# Altium schematic sheet NAVC.SchDoc
size 297 x 209 mm
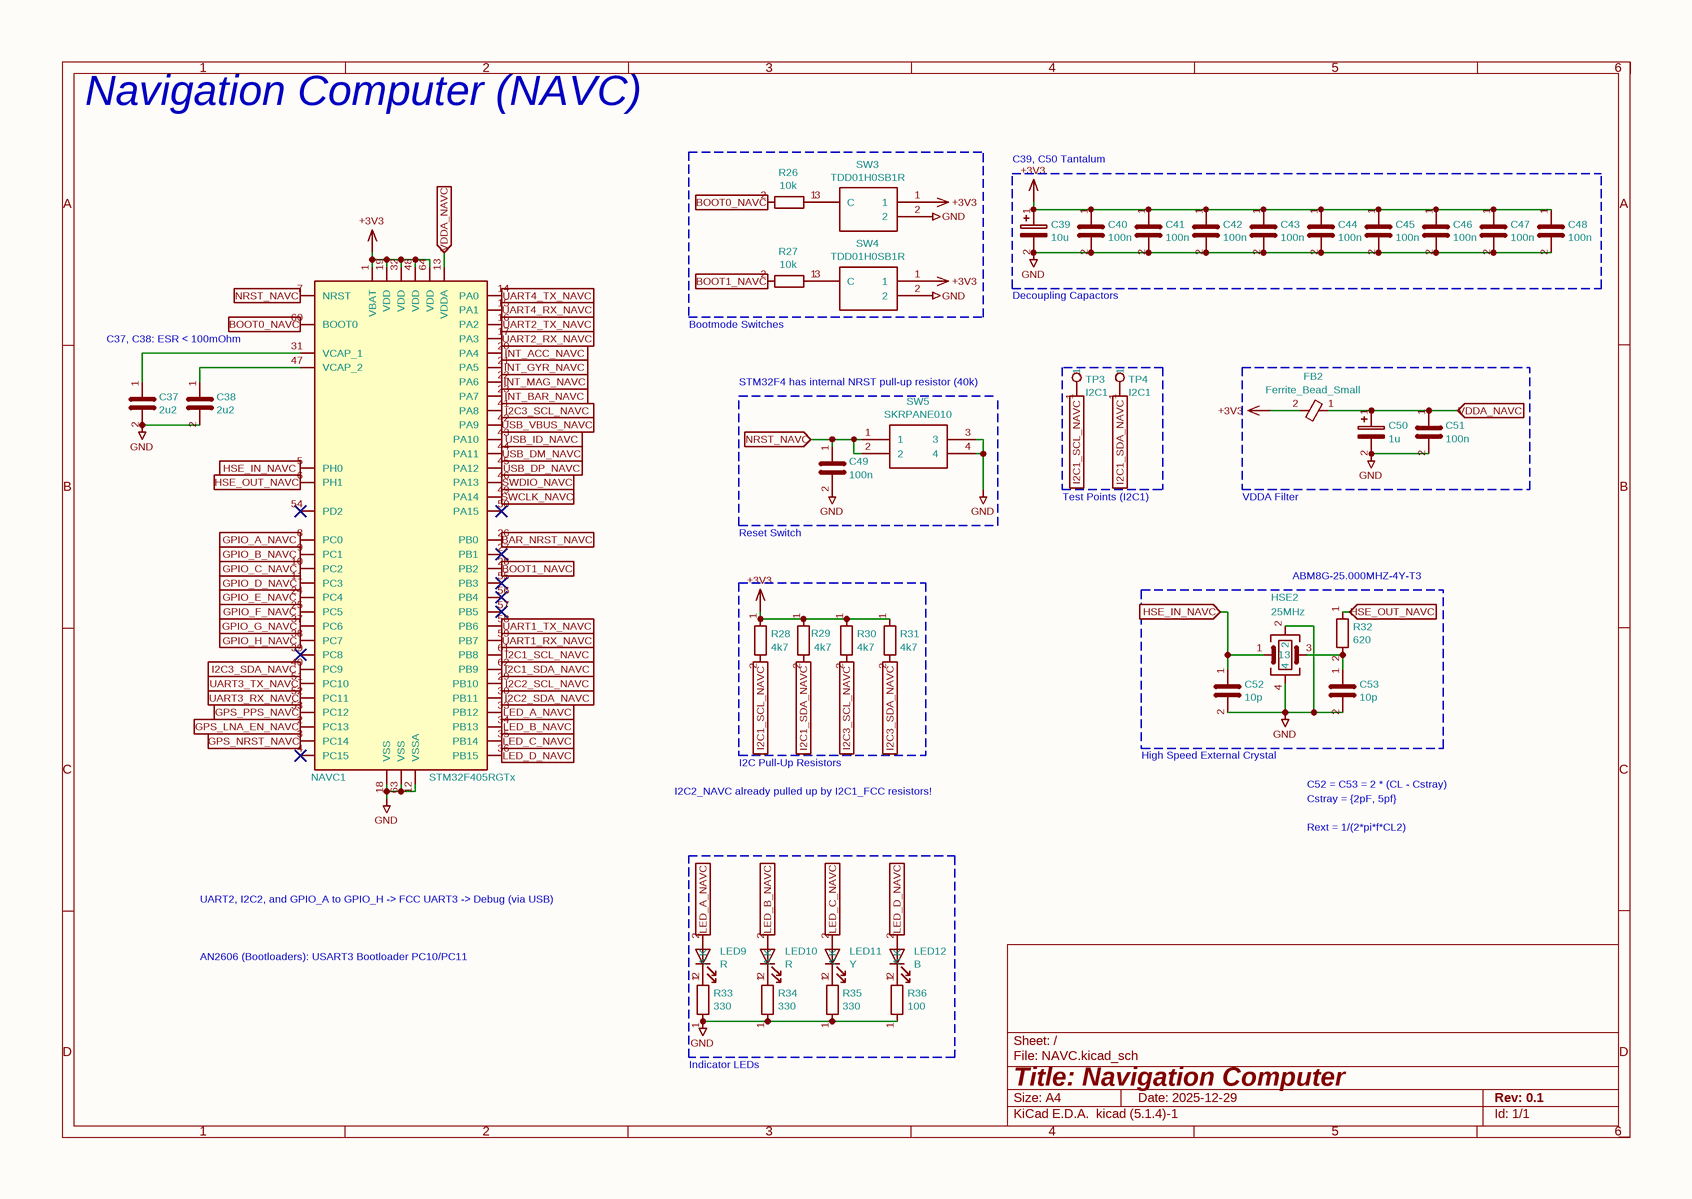
[diagram p0: NAVC.SchDoc]

## Parts
C37  2u2  [C_0603_1608Metric]
C38  2u2  [C_0603_1608Metric]
C39  10u  [C_0603_1608Metric]
C40  100n  [C_0402_1005Metric]
C41  100n  [C_0402_1005Metric]
C42  100n  [C_0402_1005Metric]
C43  100n  [C_0402_1005Metric]
C44  100n  [C_0402_1005Metric]
C45  100n  [C_0402_1005Metric]
C46  100n  [C_0402_1005Metric]
C47  100n  [C_0402_1005Metric]
C48  100n  [C_0402_1005Metric]
C49  100n  [C_0402_1005Metric]
C50  1u  [C_0603_1608Metric]
C51  100n  [C_0402_1005Metric]
C52  10p  [C_0402_1005Metric]
C53  10p  [C_0402_1005Metric]
FB2  Ferrite_Bead_Small  [L_0402_1005Metric]
HSE2  25MHz  [Crystal_SMD_Abracon_ABM8G-4Pin_3.2x2.5mm]
LED9  R  [LED_0603_1608Metric]
LED10  R  [LED_0603_1608Metric]
LED11  Y  [LED_0603_1608Metric]
LED12  B  [LED_0603_1608Metric]
NAVC1  STM32F405RGTx  [LQFP-64_10x10mm_P0.5mm]
R26  10k  [R_0402_1005Metric]
R27  10k  [R_0402_1005Metric]
R28  4k7  [R_0402_1005Metric]
R29  4k7  [R_0402_1005Metric]
R30  4k7  [R_0402_1005Metric]
R31  4k7  [R_0402_1005Metric]
R32  620  [R_0603_1608Metric]
R33  330  [R_0603_1608Metric]
R34  330  [R_0603_1608Metric]
R35  330  [R_0603_1608Metric]
R36  100  [R_0603_1608Metric]
SW3  TDD01H0SB1R  [SOT175P420X230-3N]
SW4  TDD01H0SB1R  [SOT175P420X230-3N]
SW5  SKRPANE010  [SKRPADE010]
TP3  I2C1  [TestPoint_Pad_D1.5mm]
TP4  I2C1  [TestPoint_Pad_D1.5mm]

## Blocks framed on the sheet
C39, C50 Tantalum: C39-C48
STM32F4 has internal / NRST pull-up resistor (40k): C49 SW5
ABM8G-25.000MHZ-4Y-T3: C52 C53 HSE2 R32

## Ports
BAR_NRST_NAVC (in), BOOT0_NAVC (in), BOOT1_NAVC (in), GPIO_A_NAVC (in), GPIO_B_NAVC (in), GPIO_C_NAVC (in), GPIO_D_NAVC (in), GPIO_E_NAVC (in), GPIO_F_NAVC (in), GPIO_G_NAVC (in), GPIO_H_NAVC (in), GPS_LNA_EN_NAVC (in), GPS_NRST_NAVC (in), GPS_PPS_NAVC (in), HSE_IN_NAVC (in), HSE_OUT_NAVC (in), I2C1_SCL_NAVC (in), I2C1_SDA_NAVC (in), I2C2_SCL_NAVC (in), I2C2_SDA_NAVC (in), I2C3_SCL_NAVC (in), I2C3_SDA_NAVC (in), INT_ACC_NAVC (in), INT_BAR_NAVC (in), INT_GYR_NAVC (in), INT_MAG_NAVC (in), LED_A_NAVC (in), LED_B_NAVC (in), LED_C_NAVC (in), LED_D_NAVC (in), NRST_NAVC (in), SWCLK_NAVC (in), SWDIO_NAVC (in), UART1_RX_NAVC (in), UART1_TX_NAVC (in), UART2_RX_NAVC (in), UART2_TX_NAVC (in), UART3_RX_NAVC (in), UART3_TX_NAVC (in), UART4_RX_NAVC (in), UART4_TX_NAVC (in), USB_DM_NAVC (in), USB_DP_NAVC (in), USB_ID_NAVC (in), USB_VBUS_NAVC (in), VDDA_NAVC (in)

## Nets
+3V3: C39.1 C40.1 C41.1 C42.1 C43.1 C44.1 C45.1 C46.1 C47.1 C48.1 FB2.2 NAVC1.1(VBAT) NAVC1.19(VDD) NAVC1.32(VDD) NAVC1.48(VDD) NAVC1.64(VDD) R28.1 R29.1 R30.1 R31.1 SW3.1 SW4.1
GND: C37.2 C38.2 C39.2 C40.2 C41.2 C42.2 C43.2 C44.2 C45.2 C46.2 C47.2 C48.2 C49.2 C50.2 C51.2 C52.2 C53.2 HSE2.2 HSE2.4 NAVC1.12(VSSA) NAVC1.18(VSS) NAVC1.63(VSS) R33.1 R34.1 R35.1 R36.1 SW3.2 SW4.2 SW5.3 SW5.4
BAR_NRST_NAVC: NAVC1.26(PB0) ; port BAR_NRST_NAVC
BOOT0_NAVC: NAVC1.60(BOOT0) R26.2 ; port BOOT0_NAVC
BOOT1_NAVC: NAVC1.28(PB2) R27.2 ; port BOOT1_NAVC
GPIO_A_NAVC: NAVC1.8(PC0) ; port GPIO_A_NAVC
GPIO_B_NAVC: NAVC1.9(PC1) ; port GPIO_B_NAVC
GPIO_C_NAVC: NAVC1.10(PC2) ; port GPIO_C_NAVC
GPIO_D_NAVC: NAVC1.11(PC3) ; port GPIO_D_NAVC
GPIO_E_NAVC: NAVC1.24(PC4) ; port GPIO_E_NAVC
GPIO_F_NAVC: NAVC1.25(PC5) ; port GPIO_F_NAVC
GPIO_G_NAVC: NAVC1.37(PC6) ; port GPIO_G_NAVC
GPIO_H_NAVC: NAVC1.38(PC7) ; port GPIO_H_NAVC
GPS_LNA_EN_NAVC: NAVC1.2(PC13) ; port GPS_LNA_EN_NAVC
GPS_NRST_NAVC: NAVC1.3(PC14) ; port GPS_NRST_NAVC
GPS_PPS_NAVC: NAVC1.53(PC12) ; port GPS_PPS_NAVC
HSE_IN_NAVC: C52.1 HSE2.1 NAVC1.5(PH0) ; port HSE_IN_NAVC
HSE_OUT_NAVC: NAVC1.6(PH1) R32.1 ; port HSE_OUT_NAVC
I2C1_SCL_NAVC: NAVC1.61(PB8) R28.2 TP3.1 ; port I2C1_SCL_NAVC
I2C1_SDA_NAVC: NAVC1.62(PB9) R29.2 TP4.1 ; port I2C1_SDA_NAVC
I2C2_SCL_NAVC: NAVC1.29(PB10) ; port I2C2_SCL_NAVC
I2C2_SDA_NAVC: NAVC1.30(PB11) ; port I2C2_SDA_NAVC
I2C3_SCL_NAVC: NAVC1.41(PA8) R30.2 ; port I2C3_SCL_NAVC
I2C3_SDA_NAVC: NAVC1.40(PC9) R31.2 ; port I2C3_SDA_NAVC
INT_ACC_NAVC: NAVC1.20(PA4) ; port INT_ACC_NAVC
INT_BAR_NAVC: NAVC1.23(PA7) ; port INT_BAR_NAVC
INT_GYR_NAVC: NAVC1.21(PA5) ; port INT_GYR_NAVC
INT_MAG_NAVC: NAVC1.22(PA6) ; port INT_MAG_NAVC
LED_A_NAVC: LED9.2(A) NAVC1.33(PB12) ; port LED_A_NAVC
LED_B_NAVC: LED10.2(A) NAVC1.34(PB13) ; port LED_B_NAVC
LED_C_NAVC: LED11.2(A) NAVC1.35(PB14) ; port LED_C_NAVC
LED_D_NAVC: LED12.2(A) NAVC1.36(PB15) ; port LED_D_NAVC
NRST_NAVC: C49.1 NAVC1.7(NRST) SW5.1 SW5.2 ; port NRST_NAVC
SWCLK_NAVC: NAVC1.49(PA14) ; port SWCLK_NAVC
SWDIO_NAVC: NAVC1.46(PA13) ; port SWDIO_NAVC
UART1_RX_NAVC: NAVC1.59(PB7) ; port UART1_RX_NAVC
UART1_TX_NAVC: NAVC1.58(PB6) ; port UART1_TX_NAVC
UART2_RX_NAVC: NAVC1.17(PA3) ; port UART2_RX_NAVC
UART2_TX_NAVC: NAVC1.16(PA2) ; port UART2_TX_NAVC
UART3_RX_NAVC: NAVC1.52(PC11) ; port UART3_RX_NAVC
UART3_TX_NAVC: NAVC1.51(PC10) ; port UART3_TX_NAVC
UART4_RX_NAVC: NAVC1.15(PA1) ; port UART4_RX_NAVC
UART4_TX_NAVC: NAVC1.14(PA0) ; port UART4_TX_NAVC
USB_DM_NAVC: NAVC1.44(PA11) ; port USB_DM_NAVC
USB_DP_NAVC: NAVC1.45(PA12) ; port USB_DP_NAVC
USB_ID_NAVC: NAVC1.43(PA10) ; port USB_ID_NAVC
USB_VBUS_NAVC: NAVC1.42(PA9) ; port USB_VBUS_NAVC
VDDA_NAVC: C50.1 C51.1 FB2.1 NAVC1.13(VDDA) ; port VDDA_NAVC
NetC37_1: C37.1 NAVC1.31(VCAP_1)
NetC38_1: C38.1 NAVC1.47(VCAP_2)
NetC53_1: C53.1 HSE2.3 R32.2
NetLED9_1: LED9.1(K) R33.2
NetLED10_1: LED10.1(K) R34.2
NetLED11_1: LED11.1(K) R35.2
NetLED12_1: LED12.1(K) R36.2
NetR26_1: R26.1 SW3.3(C)
NetR27_1: R27.1 SW4.3(C)

Not connected (* = marked no-connect by the designer): NAVC1 4(PC15)* 27(PB1)* 39(PC8)* 50(PA15)* 54(PD2)* 55(PB3)* 56(PB4)* 57(PB5)*

## Notes on the sheet
- Navigation Computer (NAVC)
- C37, C38: ESR < 100mOhm
- (near R27) Bootmode Switches
- Decoupling Capactors
- Test Points (I2C1)
- VDDA Filter
- Reset Switch
- I2C2_NAVC already pulled up by I2C1_FCC resistors!
- I2C Pull-Up Resistors
- High Speed External Crystal
- C52 = C53 = 2 * (CL - Cstray)
- Rext = 1/(2*pi*f*CL2)
- Cstray = {2pF, 5pf}
- UART2, I2C2, and GPIO_A to GPIO_H -> FCC
  UART3 -> Debug (via USB)
- AN2606 (Bootloaders): USART3 Bootloader PC10/PC11
- Indicator LEDs
- 1
- 2
- 3
- 4
- 5
- 6
- A
- B
- C
- D
- Title: Navigation Computer
- File: NAVC.kicad_sch
- Sheet: /
- KiCad E.D.A.  kicad (5.1.4)-1
- Size: A4
- Date: 2025-12-29
- Rev: 0.1
- Id: 1/1

## Library data of the parts
C37 C38 C40-C49 C51-C53 = C
  C37 C38: Value: 2u2; Footprint: Capacitor_SMD:C_0603_1608Metric
  C40-C49 C51: Value: 100n; Footprint: Capacitor_SMD:C_0402_1005Metric
  C52 C53: Value: 10p; Footprint: Capacitor_SMD:C_0402_1005Metric
C39 C50 = CP-Device: Footprint: Capacitor_SMD:C_0603_1608Metric
  C39: Value: 10u
  C50: Value: 1u
FB2 = Ferrite_Bead_Small-Device: Value: Ferrite_Bead_Small; Footprint: Inductor_SMD:L_0402_1005Metric
HSE2 = Crystal_GND24: Value: 25MHz; Footprint: Crystal:Crystal_SMD_Abracon_ABM8G-4Pin_3.2x2.5mm
LED9-LED12 = LED: Footprint: LED_SMD:LED_0603_1608Metric
  LED9 LED10: Value: R
  LED11: Value: Y
  LED12: Value: B
NAVC1 = STM32F405RGTx-MCU_ST_STM32F4: Value: STM32F405RGTx; Footprint: Package_QFP:LQFP-64_10x10mm_P0.5mm
R26-R36 = R
  R26 R27: Value: 10k; Footprint: Resistor_SMD:R_0402_1005Metric
  R28-R31: Value: 4k7; Footprint: Resistor_SMD:R_0402_1005Metric
  R32: Value: 620; Footprint: Resistor_SMD:R_0603_1608Metric
  R33-R35: Value: 330; Footprint: Resistor_SMD:R_0603_1608Metric
  R36: Value: 100; Footprint: Resistor_SMD:R_0603_1608Metric
SW3 SW4 = TDD01H0SB1R: Manufacturer_Name: C & K COMPONENTS; Height: 2.3; Manufacturer_Part_Number: TDD01H0SB1R; Mouser Part Number: 611-TDD01H0SB1R; Mouser Price/Stock: https://www.mouser.com/Search/Refine.aspx?Keyword=611-TDD01H0SB1R; Value: TDD01H0SB1R; Footprint: TDD01H0SB1R:SOT175P420X230-3N
SW5 = SKRPANE010: Manufacturer_Name: ALPS; Height: 2; Manufacturer_Part_Number: SKRPANE010; Mouser Part Number: 688-SKRPANE010; Mouser Price/Stock: https://www.mouser.com/Search/Refine.aspx?Keyword=688-SKRPANE010; Value: SKRPANE010; Footprint: SKRPANE010:SKRPADE010
TP3 TP4 = TestPoint: Value: I2C1; Footprint: TestPoint:TestPoint_Pad_D1.5mm